# Altium schematic sheet TopLevel.SchDoc
size A4; SheetNumber: 1; SheetTotal: 11
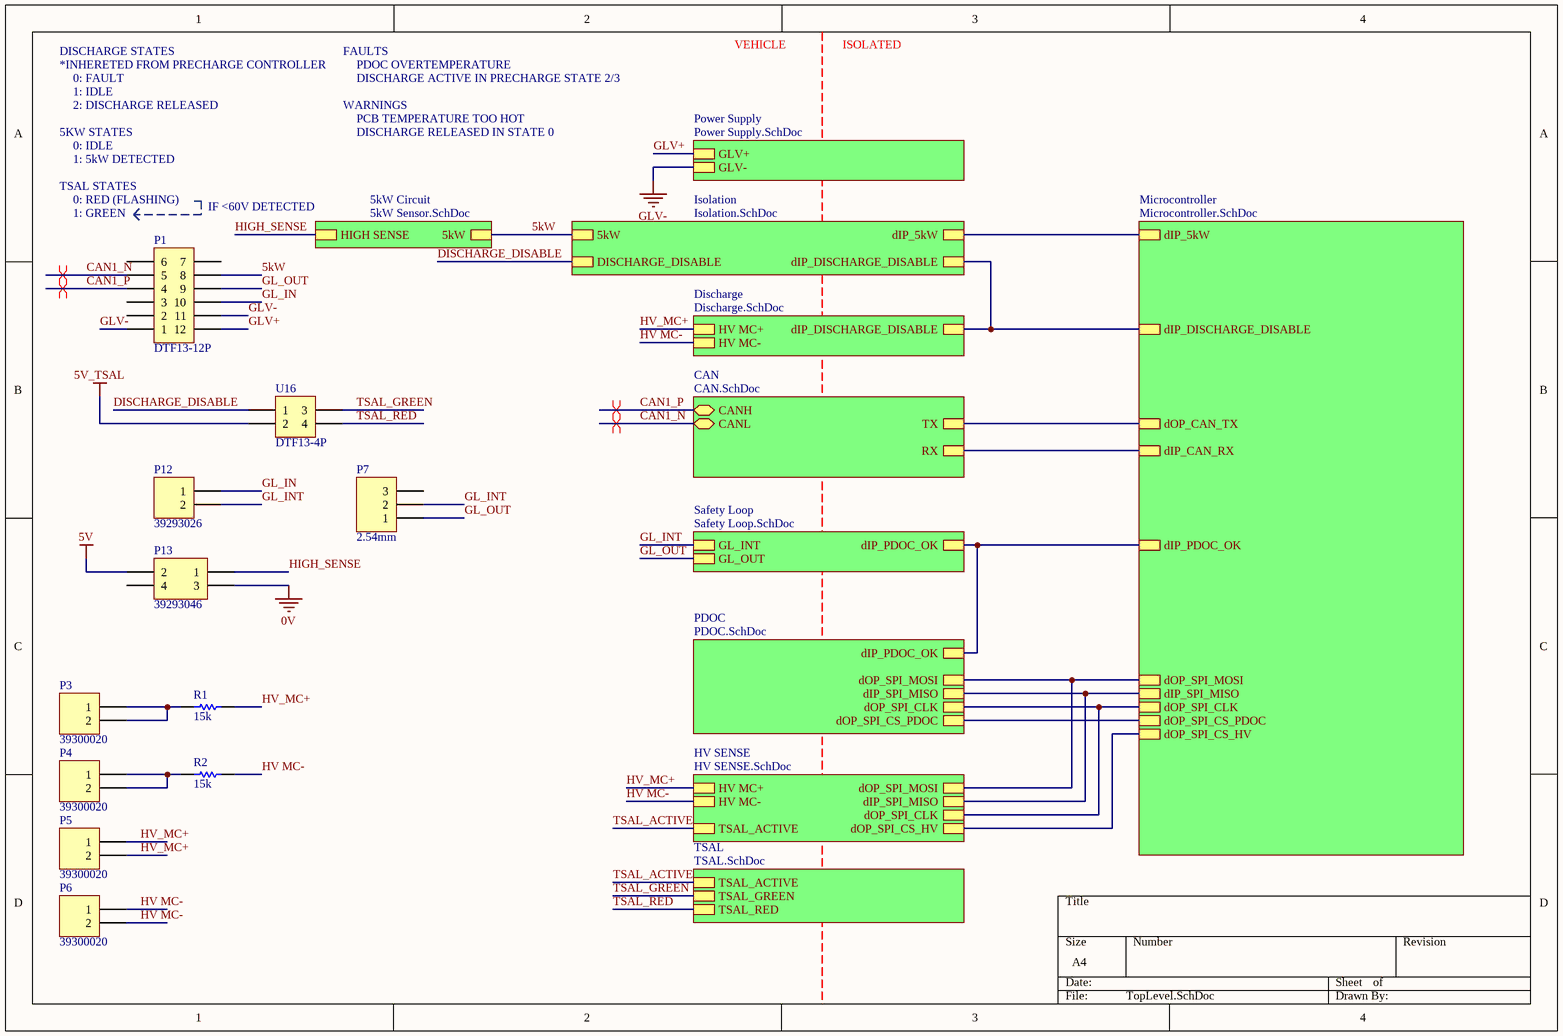
[diagram p0: TopLevel.SchDoc]

## Parts
P1  DTF13-12P  [DTF13-12P]
P3  39300020  [39300020]
P4  39300020  [39300020]
P5  39300020  [39300020]
P6  39300020  [39300020]
P7  2.54mm  [TH 2.54mm Header 1x3]
P12  39293026  [39293026]
P13  39293046  [39293046]
R1  15k  [TE_SMF7]
R2  15k  [TE_SMF7]
U16  DTF13-4P  [DTF13-4P]

## Sub-sheets
5kW Circuit = 5kW Sensor.SchDoc: 5kW, HIGH SENSE
CAN = CAN.SchDoc: CANH (bidir), CANL (bidir), TX, RX
Discharge = Discharge.SchDoc: dIP_DISCHARGE_DISABLE, HV MC+, HV MC-
HV SENSE = HV SENSE.SchDoc: HV MC+, HV MC-, dOP_SPI_MOSI, dIP_SPI_MISO, dOP_SPI_CLK, dOP_SPI_CS_HV, TSAL_ACTIVE
Isolation = Isolation.SchDoc: dIP_DISCHARGE_DISABLE, DISCHARGE_DISABLE, 5kW, dIP_5kW
Microcontroller = Microcontroller.SchDoc: dIP_PDOC_OK, dIP_DISCHARGE_DISABLE, dIP_5kW, dOP_CAN_TX, dIP_CAN_RX, dOP_SPI_MOSI, dIP_SPI_MISO, dOP_SPI_CLK, dOP_SPI_CS_PDOC, dOP_SPI_CS_HV
PDOC = PDOC.SchDoc: dIP_PDOC_OK, dOP_SPI_CLK, dOP_SPI_MOSI, dIP_SPI_MISO, dOP_SPI_CS_PDOC
Power Supply = Power Supply.SchDoc: GLV+, GLV-
Safety Loop = Safety Loop.SchDoc: GL_INT, GL_OUT, dIP_PDOC_OK
TSAL = TSAL.SchDoc: TSAL_GREEN, TSAL_RED, TSAL_ACTIVE

## Nets
0V: P13.3
5V: P13.2
5V_TSAL: U16.2
GLV-: P1.1 P1.11 ; sheet Power Supply/GLV-
5kW: P1.8 ; sheet Isolation/5kW, sheet 5kW Circuit/5kW
CAN1_N: P1.5 ; sheet CAN/CANL
CAN1_P: P1.4 ; sheet CAN/CANH
DISCHARGE_DISABLE: U16.1 ; sheet Isolation/DISCHARGE_DISABLE
GL_IN: P1.10 P12.1
GL_INT: P7.2 P12.2 ; sheet Safety Loop/GL_INT
GL_OUT: P1.9 P7.1 ; sheet Safety Loop/GL_OUT
GLV+: P1.12 ; sheet Power Supply/GLV+
HIGH_SENSE: P13.1 ; sheet 5kW Circuit/HIGH SENSE
HV MC-: P6.1 P6.2 R2.2 ; sheet Discharge/HV MC-, sheet HV SENSE/HV MC-
HV_MC+: P5.1 P5.2 R1.2 ; sheet Discharge/HV MC+, sheet HV SENSE/HV MC+
TSAL_ACTIVE: sheet HV SENSE/TSAL_ACTIVE, sheet TSAL/TSAL_ACTIVE
TSAL_GREEN: U16.3 ; sheet TSAL/TSAL_GREEN
TSAL_RED: U16.4 ; sheet TSAL/TSAL_RED
NetP3_1: P3.1 P3.2 R1.1
NetP4_1: P4.1 P4.2 R2.1
(unnamed): sheet Isolation/dIP_DISCHARGE_DISABLE, sheet Discharge/dIP_DISCHARGE_DISABLE, sheet Microcontroller/dIP_DISCHARGE_DISABLE
(unnamed): sheet Isolation/dIP_5kW, sheet Microcontroller/dIP_5kW
(unnamed): sheet Safety Loop/dIP_PDOC_OK, sheet PDOC/dIP_PDOC_OK, sheet Microcontroller/dIP_PDOC_OK
(unnamed): sheet PDOC/dOP_SPI_CLK, sheet HV SENSE/dOP_SPI_CLK, sheet Microcontroller/dOP_SPI_CLK
(unnamed): sheet PDOC/dOP_SPI_MOSI, sheet HV SENSE/dOP_SPI_MOSI, sheet Microcontroller/dOP_SPI_MOSI
(unnamed): sheet PDOC/dIP_SPI_MISO, sheet HV SENSE/dIP_SPI_MISO, sheet Microcontroller/dIP_SPI_MISO
(unnamed): sheet PDOC/dOP_SPI_CS_PDOC, sheet Microcontroller/dOP_SPI_CS_PDOC
(unnamed): sheet HV SENSE/dOP_SPI_CS_HV, sheet Microcontroller/dOP_SPI_CS_HV
(unnamed): sheet Microcontroller/dOP_CAN_TX, sheet CAN/TX
(unnamed): sheet Microcontroller/dIP_CAN_RX, sheet CAN/RX

Not connected (* = marked no-connect by the designer): P1 2 3 6 7; P7 3; P13 4

## Layout directives
differential pair: CAN1_N, CAN1_P

## Notes on the sheet
- DISCHARGE STATES
- *INHERETED FROM PRECHARGE CONTROLLER
- 0: FAULT
- 1: IDLE
- 2: DISCHARGE RELEASED
- FAULTS
- WARNINGS
- PDOC OVERTEMPERATURE
- DISCHARGE ACTIVE IN PRECHARGE STATE 2/3
- VEHICLE
- ISOLATED
- 5KW STATES
- 1: 5kW DETECTED
- 0: IDLE
- PCB TEMPERATURE TOO HOT
- DISCHARGE RELEASED IN STATE 0
- TSAL STATES
- 0: RED (FLASHING)
- (near P1) 1: GREEN
- (near P1) IF <60V DETECTED

## Library data of the parts
P1 = DTF13-12P: Positions: 12; Pitch: 4.45mm; Angle: 90; Flange: No; Contact: Copper Alloy; Part Number: DTF13-12P; Row Spacing: 4.45mm; Digikey Part Number: 1734-1861-ND; Digikey Link: https://www.digikey.com/products/en?keywords=dtf13-12pa
P3-P6 = 39300020: Pitch: 4.2mm; Row Spacing: 5.5mm; Angle: 90; Flange: No; Contact: Tin; Part Number: 39300020; Positions: 2; Digikey Part Number: WM21351-ND
P7 = TH 2.54mm Header 1x3: Positions: 3; Angle: 0; Flange: No; Contact: NA; Part Number: TH 2.54mm Header 1x3; Pitch: 2.54mm; Row Spacing: 2.54mm
P12 = 39293026: Pitch: 4.2mm; Row Spacing: 5.5mm; Angle: 0; Flange: No; Contact: Tin; Part Number: 39293026; Positions: 2; Digikey Part Number: WM3843-ND
P13 = 39293046: Pitch: 4.2mm; Row Spacing: 5.5mm; Angle: 0; Flange: No; Contact: Tin; Part Number: 39293046; Positions: 4; Digikey Part Number: WM3844-ND
R1 R2 = SMF715KJ: Manufacturer: TE; Tolerance: 0.05; Rated Power: 7W; Part Number: SMF715KJ; Value: 15k; Material: Metal Film
U16 = DTF13-4P: Positions: 4; Pitch: 9.12mm; Row Spacing: 4.45mm; Angle: 90; Flange: Yes; Contact: Copper Alloy; Part Number: DTF13-4P; Digikey Part Number: 1734-1646-ND; Digikey Link: https://www.digikey.com.au/products/en?keywords=dtf13-4p